# EAGLE design MAX4995C - Programmable Current-Limit Switch (EAGLE 9.4.0)
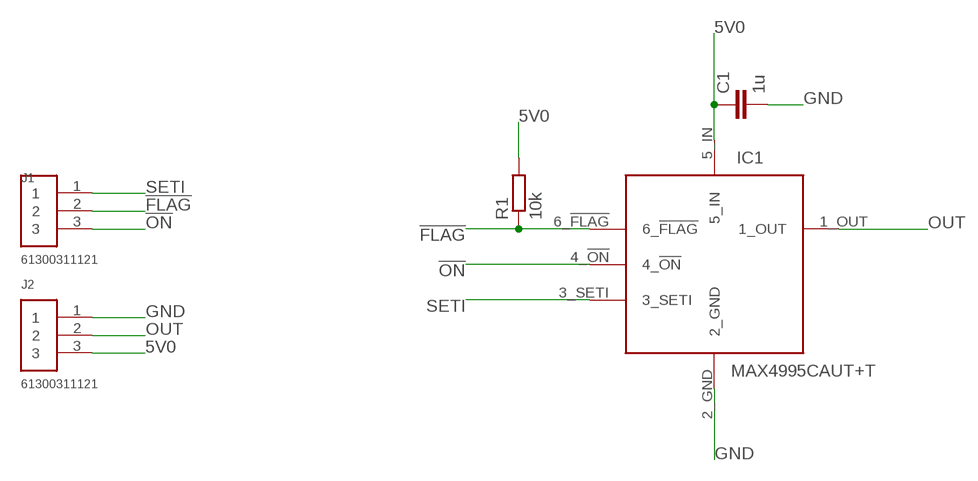
[diagram p0: schematic, sheet 1]

## Parts
C1  1u  C-EUC0805  [C0805]
IC1  MAX4995CAUT+T  MAX4995C  [SOT23-6]
J1  61300311121  [61300311121]
J2  61300311121  [61300311121]
R1  10k  R-EU_R0805  [R0805]

## Nets
5V0 [Vcc]: C1.1 IC1.5_IN J2.3 R1.2
!FLAG! [signal]: IC1.6_!FLAG! J1.2 R1.1
!ON! [signal]: IC1.4_!ON! J1.3
GND: C1.2 IC1.2_GND J2.1
OUT [Vcc]: IC1.1_OUT J2.2
SETI [Vcc]: IC1.3_SETI J1.1

## Library data of the parts
C1 = rcl:C-EU: CAPACITOR, European symbol; SPICEPREFIX: C
IC1 = MAX4995C - Programmable Current-Limit Switch:MAX4995C
J1 J2 = Headers:61300311121: CONN HEADER VERT 3POS 2.54MM Manufacturer's datasheet <https://katalog.we-online.de/em/datasheet/6130xx11121.pdf>; CREATED_BY: PCBLayout.com; DIGI_KEY_PART_NUMBER: 732-5316-ND; MANUFACTURER: Wurth Electronics Inc.; MPN: 61300311121
R1 = rcl:R-EU_: RESISTOR, European symbol; SPICEPREFIX: R

## Net classes
0 GND: width 0.35 mm, drill 0.35 mm, clearance 0.2 mm
1 Vcc: width 0.35 mm, drill 0.35 mm, clearance 0.2 mm
2 signal: width 0.35 mm, drill 0.35 mm, clearance 0.2 mm

## Board
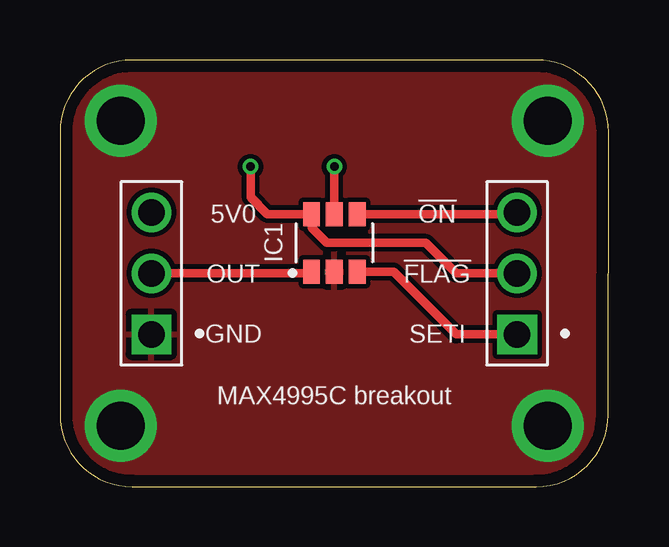
[diagram p1: board, top side]
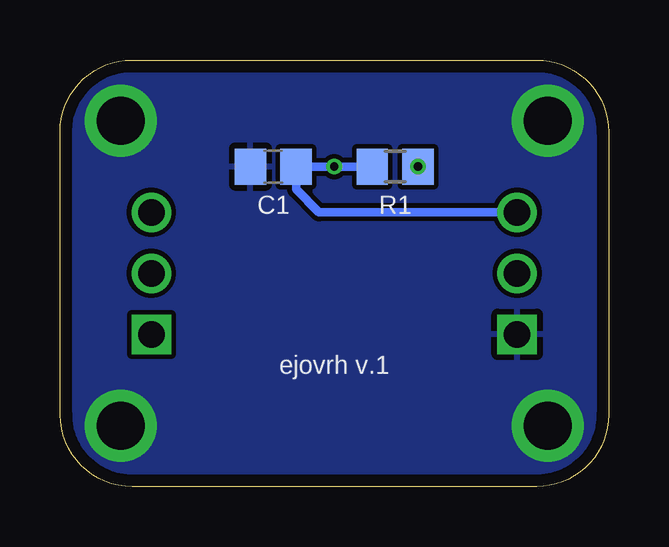
[diagram p2: board, bottom side, seen from below]

Size 22.86 x 17.78 mm. Coordinates in mm from the lower left corner, seen from the top.
Outline: 0,14.78 0,3 arc90 3,0 19.84,0 arc90 22.84,3 22.86,14.78 arc90 19.86,17.78 3,17.78 arc90 0,14.78
Copper layers (1*16): Top 0.035mm / dielectric 1.5mm / Bottom 0.035mm
Design rules "markovac_2layer": minimum track width 0.2mm, minimum drill 0.35mm, track to track 0.2mm, track to pad 0.2mm, pad to pad 0.2mm, via to via 0.2mm, smd to smd 0.2mm, copper to edge 0.5mm, drill to drill 8mil, minimum pad ring 0.15mm, minimum via ring 0.15mm, stop-mask expansion 4mil, vias tented up to drill 0.34mm, thermal gap 10mil

### Footprints (pad centres in the part's own frame; a part is rotated, then mirrored left to right if it is on the bottom)
C0805 = smd 1.3 x 1.5: 1 -0.95,0; 2 0.95,0
SOT23-6 = smd 0.7 x 1: 1_OUT -0.95,-1.2; 2_GND 0,-1.2; 3_SETI 0.95,-1.2; 4_!ON! 0.95,1.2; 5_IN 0,1.2; 6_!FLAG! -0.95,1.2
61300311121 = drill 1.1 square: 1 -2.54,0 | drill 1.1: 2 0,0; 3 2.54,0
R0805 = smd 1.3 x 1.5: 1 -0.95,0; 2 0.95,0

### Placement (x,y rotation side)
C1  13.97,13.33 180 bottom
IC1  11.43,10.16 0 top
J1  19.05,8.89 90 top
J2  3.81,8.89 90 top
R1  8.89,13.33 180 bottom

### Tracks (layer width: path | path; a pad name or v marks a point on that pad's centre or on a via)
5V0  (via drill 0.35)
  Top 0.35: IC1.5_IN v11.43,13.33
  Bottom 0.35: R1.2 v11.43,13.33 13.33,13.33 | J2.3 12.06,11.43 13.02,12.38 C1.1
  Bottom 0.381: C1.1 13.33,13.33
!FLAG!  (via drill 0.35)
  Top 0.35: R1.1 7.94,12.06 8.64,11.36 IC1.6_!FLAG! 10.48,10.79 11.11,10.16 15.24,10.16 16.51,8.89 J1.2
  other vias: 7.94,13.33
!ON!
  Top 0.35: J1.3 18.98,11.36 IC1.4_!ON!
GND  (via drill 2)
  other vias: 2.54,15.24 20.32,15.24 2.54,2.54 20.32,2.54
  pour Top: 0,17.78 22.86,17.78 22.86,0 0,0
  pour Bottom: 0,17.78 22.86,17.78 22.86,0 0,0
OUT
  Top 0.35: IC1.1_OUT 10.41,8.89 J2.2
SETI
  Top 0.35: J1.1 16.51,6.35 13.9,8.96 IC1.3_SETI

### Text on the board
tPlace: 5V0 | !ON! | OUT | !FLAG! | GND | SETI | MAX4995C breakout
bPlace: ejovrh v.1